# Altium project ECUs Simulation Board.PrjPcb
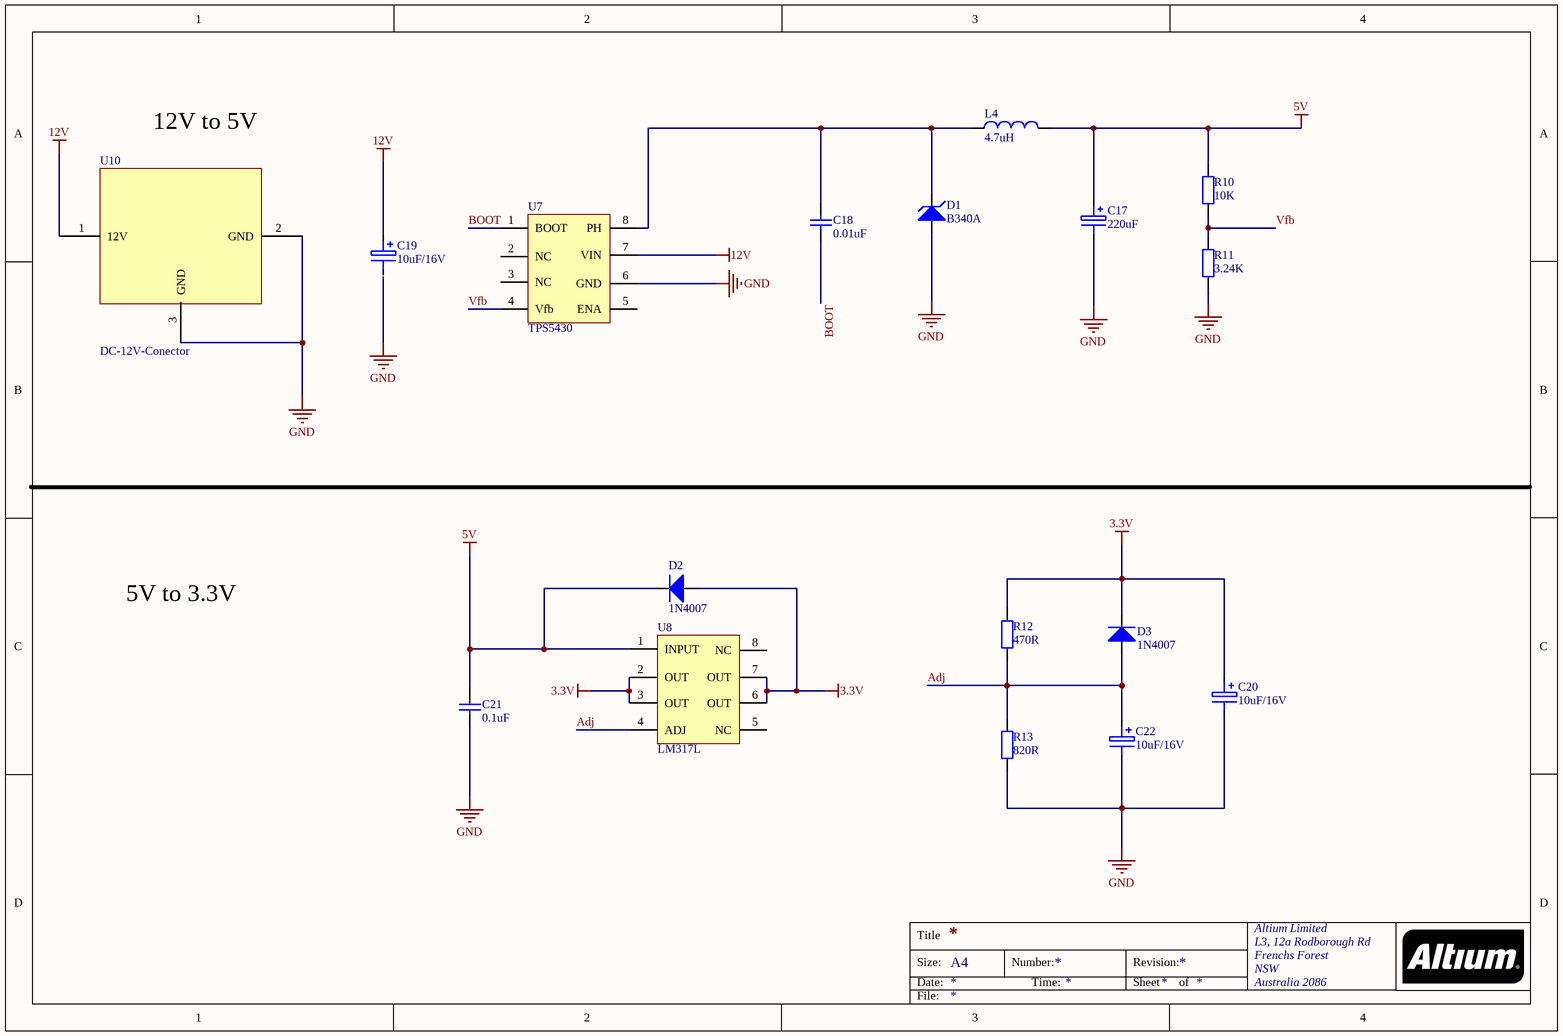
[diagram p0: Power.SchDoc]
4 sheets, 62 parts. Net scope: global (net labels, ports and power ports of the same name join across sheets).
Board files: ECUs Simulator test board.PcbDoc, ECUs.PcbDoc, ECUs Simulator.PcbDoc
Sheets:
  Power.SchDoc
  Core.SchDoc
  PL2303A.SchDoc
  USB.SchDoc

## Sheet Power.SchDoc
size A4; Organization: Altium Limited; Address1: L3, 12a Rodborough Rd; Address2: Frenchs Forest; Address3: NSW; Address4: Australia 2086

### Parts
C17  220uF  [CAPM-7.0*4.5]
C18  0.01uF  [0603]
C19  10uF/16V  [CAPM-7.0*4.5]
C20  10uF/16V  [CAPM-5.5*3.3]
C21  0.1uF  [0603]
C22  10uF/16V  [CAPM-5.5*3.3]
D1  B340A  [DO214-AC]
D2  1N4007  [DO214-AC]
D3  1N4007  [DO214-AC]
L4  4.7uH  [7*7*4-15uH]
R10  10K  [0603]
R11  3.24K  [0603]
R12  470R  [0603]
R13  820R  [0603]
U7  TPS5430  [TPS5430]
U8  LM317L  [LM317L]
U10  DC-12V-Conector  [DC-12V-Con]

### Nets
3.3V: C20.1 D2.1(A) D3.2(K) R12.2 U8.2(OUT) U8.3(OUT) U8.6(OUT) U8.7(OUT)
5V: C17.1 C21.2 D2.2(K) L4.2 R10.2 U8.1(INPUT)
12V: C19.1 U7.7(VIN) U10.1(12V)
GND: C17.2 C20.2 C21.1 C22.2 D1.1(A) R11.1 R13.1 U7.6(GND) U10.2(GND) U10.3(GND)
Adj: C22.1 D3.1(A) R12.1 R13.2 U8.4(ADJ)
BOOT: C18.1 U7.1(BOOT)
Vfb: R10.1 R11.2 U7.4(Vfb)
NetC18_2: C18.2 D1.2(K) L4.1 U7.8(PH)

Not connected (* = marked no-connect by the designer): C19 2; U7 2(NC) 3(NC) 5(ENA); U8 5(NC) 8(NC)

### Notes on the sheet
- 12V to 5V
- 5V to 3.3V
- Title
- Size:
- Date:
- A4
- Number:
- Time:
- Revision:
- Sheet
- of
- File:

### Library data of the parts
C17 C19 C20 C22 = Cap3: aluminum
C18 C21 = Cap1: ceramic
D1 = B340A-13-F
L4 = Inductor
R10-R13 = Res
U10 = DC12V-Connector

## Sheet Core.SchDoc
size A3; Organization: Altium Limited; Address1: L3, 12a Rodborough Rd; Address2: Frenchs Forest; Address3: NSW; Address4: Australia 2086
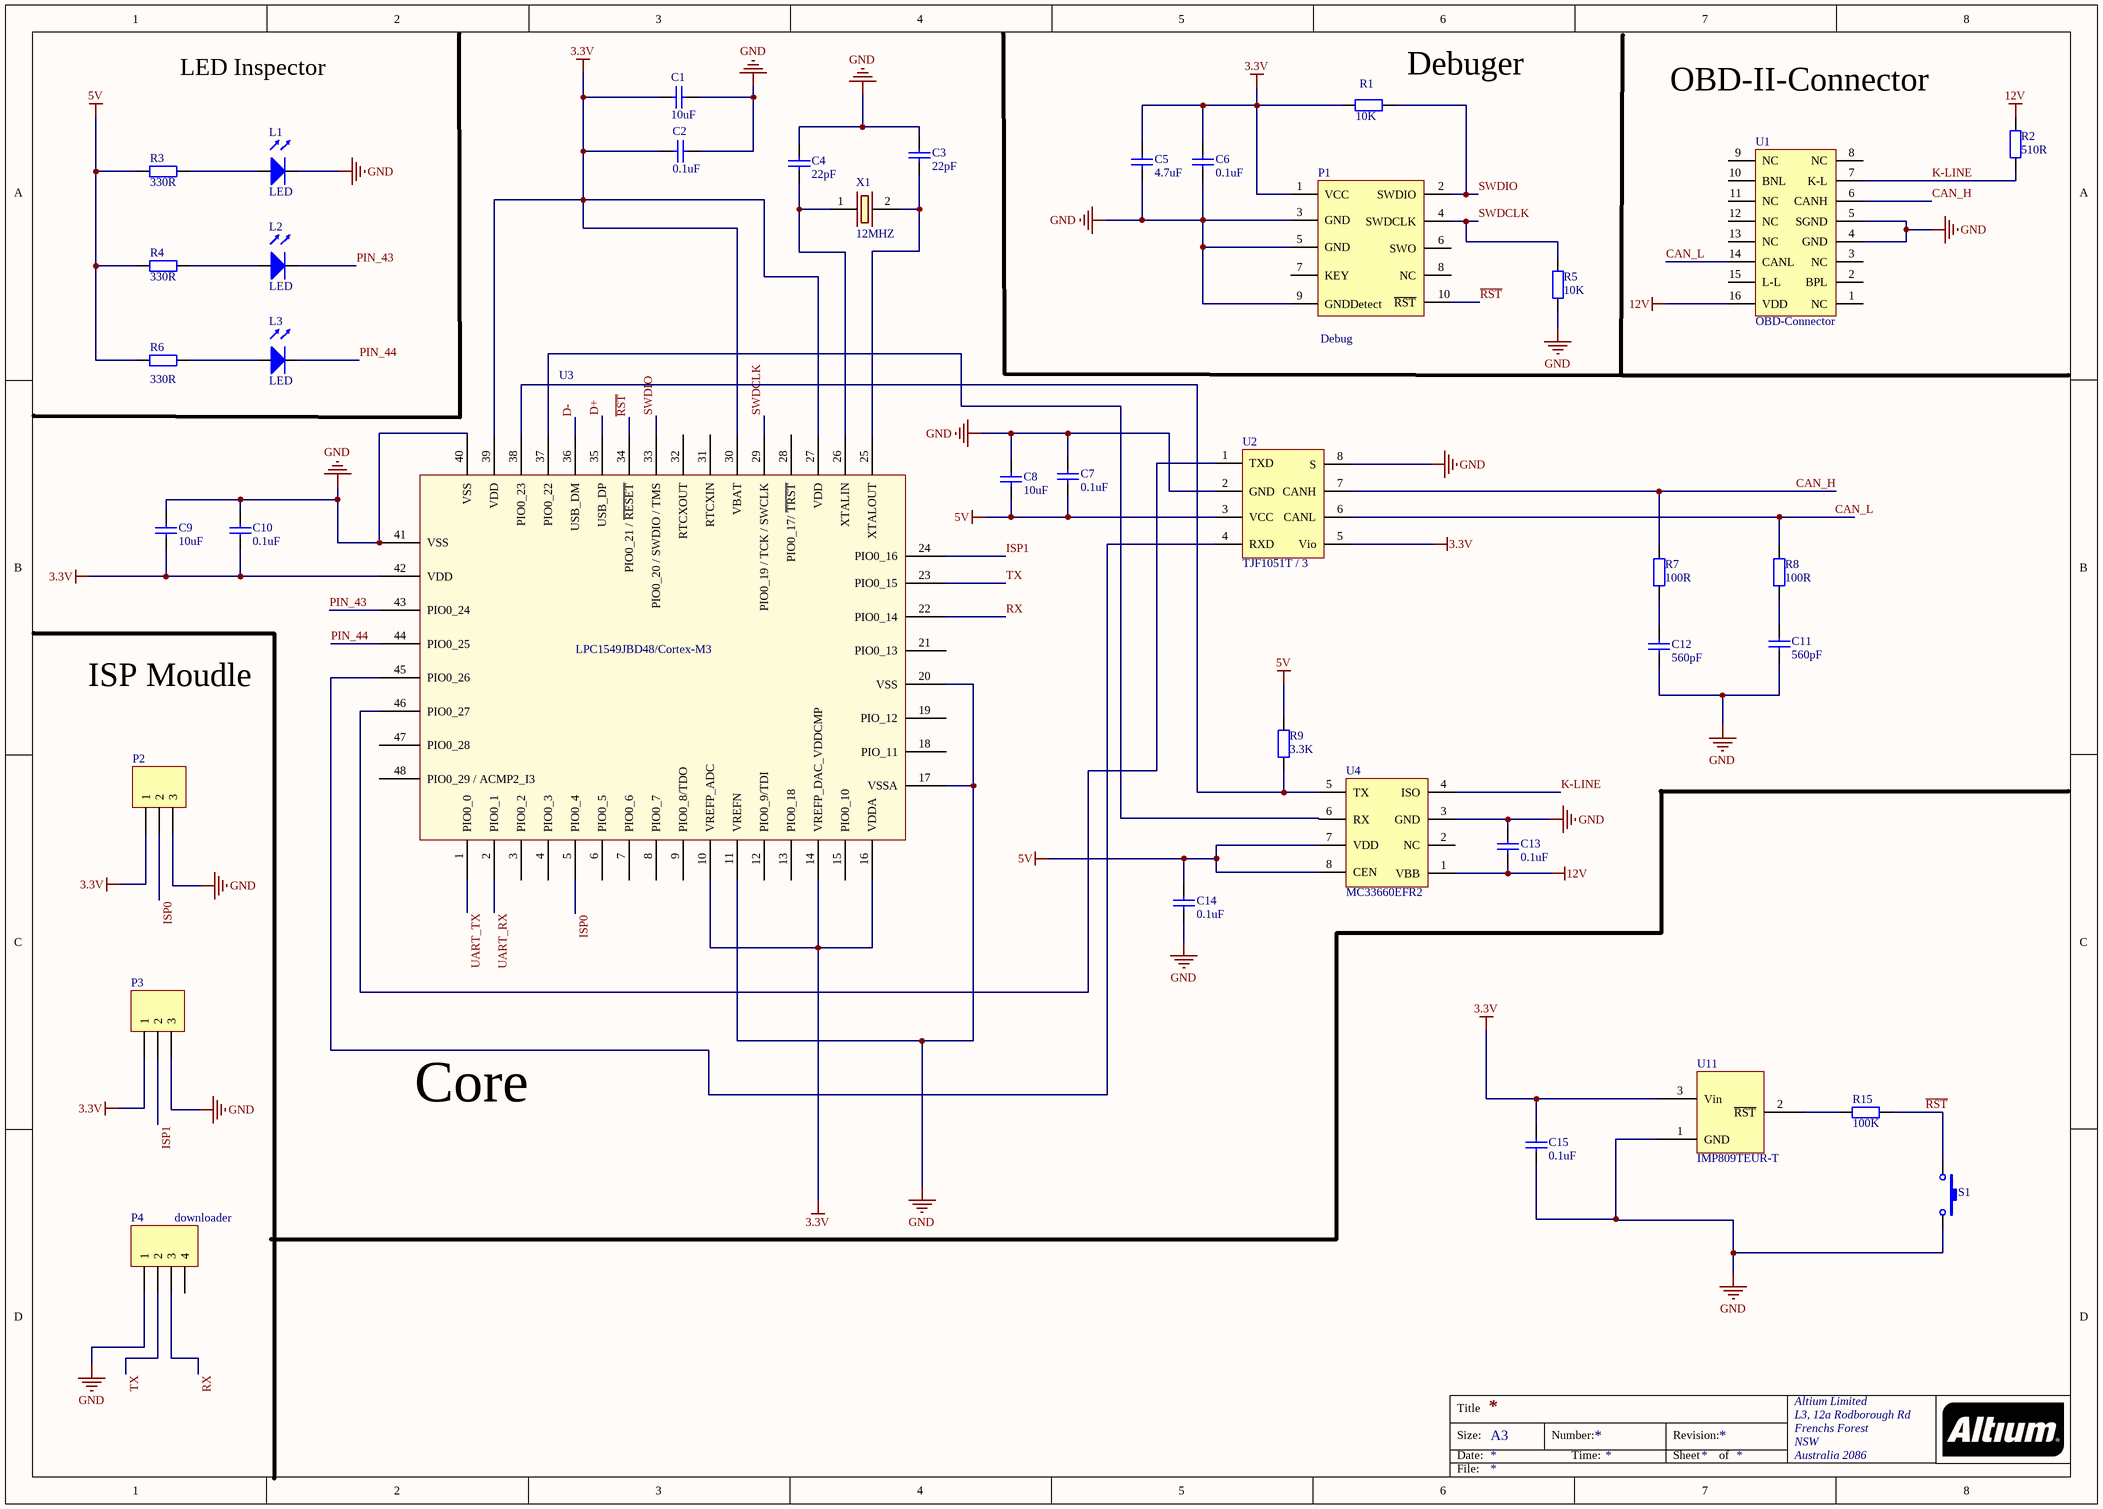
[diagram p1: Core.SchDoc]

### Parts
C1  10uF  [0603]
C2  0.1uF  [0603]
C3  22pF  [0603]
C4  22pF  [0603]
C5  4.7uF  [0603]
C6  0.1uF  [0603]
C7  0.1uF  [0603]
C8  10uF  [0603]
C9  10uF  [0603]
C10  0.1uF  [0603]
C11  560pF  [0603]
C12  560pF  [0603]
C13  0.1uF  [0603]
C14  0.1uF  [0603]
C15  0.1uF  [0603]
L1  LED  [0805]
L2  LED  [0805]
L3  LED  [0805]
P1  Debug  [JATG_10pin]
P2  (no value)  [HDR1X3]
P3  (no value)  [HDR1X3]
P4  downloader  [HDR1X4]
R1  10K  [0603]
R2  510R  [0603]
R3  330R  [0603]
R4  330R  [0603]
R5  10K  [0603]
R6  330R  [0603]
R7  100R  [0603]
R8  100R  [0603]
R9  3.3K  [0603]
R15  100K  [0603]
S1  Button  [BUtton-T4]  (value not drawn)
U1  OBD-Connector  [OBD-Female]
U2  TJF1051T / 3  [TJF1051]
U3  LPC1549  [LPC1549JBD48]  (value not drawn)
U4  MC33660EFR2  [SOP-8]
U11  IMP809TEUR-T  [SOT23-3]
X1  12MHZ  [12Mhz-DFN]

### Nets
3.3V: C1.2 C2.2 C5.2 C6.2 C9.1 C10.1 C15.2 P1.1(VCC) P2.1 P3.1 R1.1 U2.5(Vio) U3.10(VREFP_ADC) U3.14(VREFP_DAC_VDDCMP) U3.16(VDDA) U3.27(VDD) U3.30(VBAT) U3.39(VDD) U3.42(VDD) U11.3(Vin)
5V: C7.1 C8.1 C14.2 R3.1 R4.1 R6.1 R9.2 U2.3(VCC) U4.7(VDD) U4.8(CEN)
12V: C13.1 R2.2 U1.16(VDD) U4.1(VBB)
GND: C1.1 C2.1 C3.2 C4.2 C5.1 C6.1 C7.2 C8.2 C9.2 C10.2 C11.1 C12.1 C13.2 C14.1 C15.1 L1.2(K) P1.3(GND) P1.5(GND) P1.9(GNDDetect) P2.3 P3.3 P4.1 R5.1 S1.2 U1.4(GND) U1.5(SGND) U2.2(GND) U2.8(S) U3.11(VREFN) U3.17(VSSA) U3.20(VSS) U3.40(VSS) U3.41(VSS) U4.3(GND) U11.1(GND)
CAN_H: R7.2 U1.6(CANH) U2.7(CANH)
CAN_L: R8.2 U1.14(CANL) U2.6(CANL)
D+: U3.35(USB_DP)
D-: U3.36(USB_DM)
ISP0: P2.2 U3.5(PIO0_4)
ISP1: P3.2 U3.24(PIO0_16)
K-LINE: R2.1 U1.7(K-L) U4.4(ISO)
PIN_43: L2.2(K) U3.43(PIO0_24)
PIN_44: L3.2(K) U3.44(PIO0_25)
~{RST}: P1.10(~{RST}) R15.1 S1.1 U3.34(PIO0_21_/_~{RESET})
RX: P4.3 U3.22(PIO0_14)
SWDCLK: P1.4(SWDCLK) R5.2 U3.29(PIO0_19_/_TCK_/_SWCLK)
SWDIO: P1.2(SWDIO) R1.2 U3.33(PIO0_20_/_SWDIO_/_TMS)
TX: P4.2 U3.23(PIO0_15)
UART_RX: U3.2(PIO0_1)
UART_TX: U3.1(PIO0_0)
NetC3_1: C3.1 U3.25(XTALOUT) X1.2
NetC4_1: C4.1 U3.26(XTALIN) X1.1
NetC11_2: C11.2 R8.1
NetC12_2: C12.2 R7.1
NetL1_1: L1.1(A) R3.2
NetL2_1: L2.1(A) R4.2
NetL3_1: L3.1(A) R6.2
NetR9_1: R9.1 U3.38(PIO0_23) U4.5(TX)
NetR15_2: R15.2 U11.2(~{RST})
NetU2_1: U2.1(TXD) U3.46(PIO0_27)
NetU2_4: U2.4(RXD) U3.45(PIO0_26)
NetU3_37: U3.37(PIO0_22) U4.6(RX)

Not connected (* = marked no-connect by the designer): P1 6(SWO) 7(KEY) 8(NC); P4 4; U1 1(NC) 2(BPL) 3(NC) 8(NC) 9(NC) 10(BNL) 11(NC) 12(NC) 13(NC) 15(L-L); U3 3(PIO0_2) 4(PIO0_3) 6(PIO0_5) 7(PIO0_6) 8(PIO0_7) 9(PIO0_8/TDO) 12(PIO0_9/TDI) 13(PIO0_18) 15(PIO0_10) 18(PIO_11) 19(PIO_12) 21(PIO0_13) 28(PIO0_17/_~{TRST}) 31(RTCXIN) 32(RTCXOUT) 47(PIO0_28) 48(PIO0_29_/_ACMP2_I3); U4 2(NC)

### Notes on the sheet
- LED Inspector
- (near R1) Debuger
- OBD-II-Connector
- ISP Moudle
- Core
- Title
- Size:
- Date:
- A3
- Number:
- Time:
- Revision:
- Sheet
- of
- File:
- (in symbol LPC1549JBD48) LPC1549JBD48/Cortex-M3

### Library data of the parts
C1-C15 = Cap1: ceramic
P1 = JTAG_10Pin
P2 P3 = Header 3: Header, 3-Pin; LatestRevisionDate: 17-Jul-2002; LatestRevisionNote: Re-released for DXP Platform.; Publisher: Altium Limited
P4 = Header 4: Header, 4-Pin; LatestRevisionDate: 17-Jul-2002; LatestRevisionNote: Re-released for DXP Platform.; Publisher: Altium Limited
R1-R9 R15 = Res
U1 = OBD-MaleHead
U3 = LPC1549JBD48
X1 = OSC

## Sheet PL2303A.SchDoc
size A4
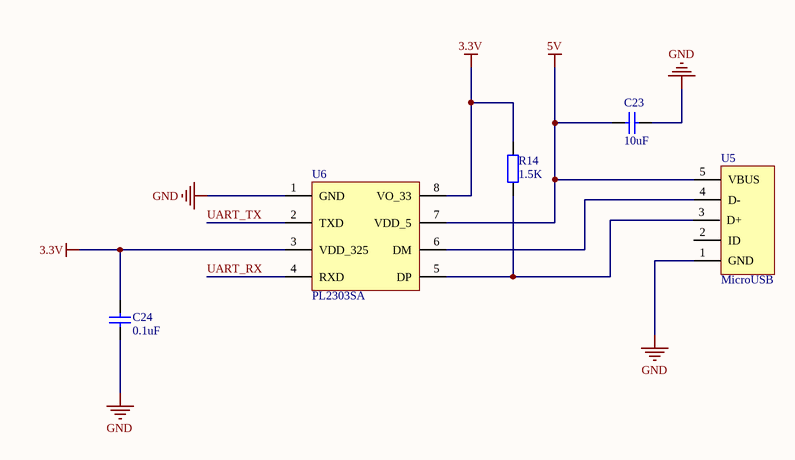
[diagram p2: PL2303A.SchDoc]

### Parts
C23  10uF  [0603]
C24  0.1uF  [0603]
R14  1.5K  [0603]
U5  MicroUSB  [Micro-USB]
U6  PL2303SA  [SOP-8]

### Nets
3.3V: C24.2 R14.2 U6.3(VDD_325) U6.8(VO_33)
5V: C23.2 U5.5(VBUS) U6.7(VDD_5)
GND: C23.1 C24.1 U5.1(GND) U6.1(GND)
UART_RX: U6.4(RXD)
UART_TX: U6.2(TXD)
NetR14_1: R14.1 U5.3(D+) U6.5(DP)
NetU5_4: U5.4(D-) U6.6(DM)

Not connected (* = marked no-connect by the designer): U5 2(ID)

### Library data of the parts
C23 C24 = Cap1: ceramic
R14 = Res
U5 = MicroUSB_B

## Sheet USB.SchDoc
size A4
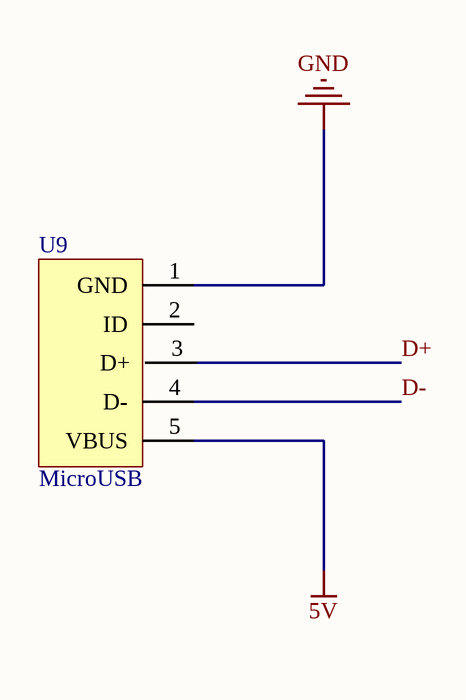
[diagram p3: USB.SchDoc]

### Parts
U9  MicroUSB  [Micro-USB]

### Nets
5V: U9.5(VBUS)
GND: U9.1(GND)
D+: U9.3(D+)
D-: U9.4(D-)

Not connected (* = marked no-connect by the designer): U9 2(ID)

### Library data of the parts
U9 = MicroUSB_B

## Nets that join several sheets
3.3V: Power (8 pins), Core (20 pins), PL2303A (C24.2 R14.2 U6.3 U6.8)
5V: Power (6 pins), Core (10 pins), PL2303A (C23.2 U5.5 U6.7), USB (U9.5)
12V: Power (C19.1 U7.7 U10.1), Core (C13.1 R2.2 U1.16 U4.1)
GND: Power (10 pins), Core (35 pins), PL2303A (C23.1 C24.1 U5.1 U6.1), USB (U9.1)
D+: Core (U3.35), USB (U9.3)
D-: Core (U3.36), USB (U9.4)
UART_RX: Core (U3.2), PL2303A (U6.4)
UART_TX: Core (U3.1), PL2303A (U6.2)